# EAGLE design PWM_v1_0 (EAGLE 9.6.2)
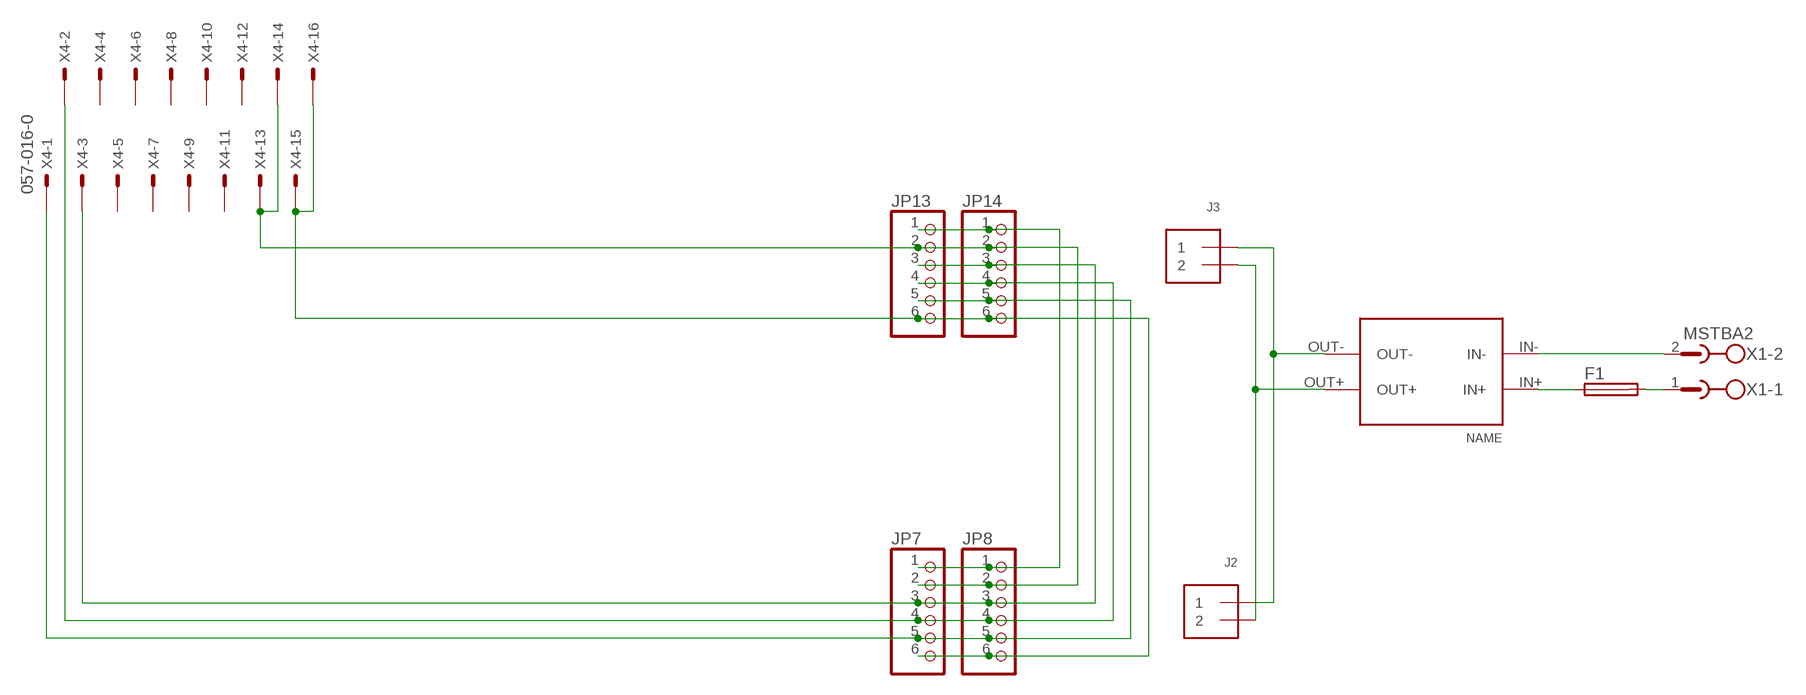
[diagram p0: schematic, sheet 1]

## Parts
F1  SH25  [SH25]
J2  TERMBLOCK_1X2  [TERMBLOCK_1X2-3.5MM]
J3  TERMBLOCK_1X2  [TERMBLOCK_1X2-3.5MM]
JP7  PINHD-1X6CB  [1X06-CLEANBIG]
JP8  PINHD-1X6CB  [1X06-CLEANBIG]
JP13  PINHD-1X6CB  [1X06-CLEANBIG]
JP14  PINHD-1X6CB  [1X06-CLEANBIG]
U$2  CP8-ADJ  [CP8-ADJ]
X1  MSTBA2  [MSTBA2]
X4  057-016-0  [057-016-0]

## Nets
N$1: J2.2 J3.2 U$2.OUT+
N$2: J2.1 J3.1 U$2.OUT-
N$3: JP7.4 JP8.4 JP13.4 JP14.4 X4.2
N$4: JP7.5 JP8.5 JP13.5 JP14.5 X4.1
N$5: JP7.6 JP8.6 JP13.6 JP14.6 X4.15 X4.16
N$6: JP7.1 JP8.1 JP13.1 JP14.1
N$7: JP7.2 JP8.2 JP13.2 JP14.2 X4.13 X4.14
N$8: U$2.IN- X1.2
N$9: F1.1 U$2.IN+
N$10: F1.2 X1.1
N$11: JP7.3 JP8.3 JP13.3 JP14.3 X4.3
Unconnected: X4.4 X4.5 X4.6 X4.7 X4.8 X4.9 X4.10 X4.11 X4.12

## Library data of the parts
F1 = fuse:SH25: FUSE HOLDER grid 25 mm, OGN0031 8211, Schurter (Buerklin); MF: SCHURTER; MPN: 0031.8211; OC_FARNELL: 1162741; OC_NEWARK: 96B9380
J2 J3 = microbuilder:TERMBLOCK_1X2: 3.5mm Terminal block http://www.ladyada.net/library/pcb/eaglelibrary.html
JP7 JP8 JP13 JP14 = adafruit:PINHD-1X6: PIN HEADER
U$2 = userlib:CP8-ADJ: Voltage regulator IN: 7-35V OUT: ADJ
X1 = con-phoenix-508:MSTBA2: PHOENIX; MF: FARNELL; MPN: 1757242; OC_FARNELL: 3705171; OC_NEWARK: 71C4161
X4 = con-panduit:057-016-: CONNECTOR 10-pin series 057 contact pc board low profile headers; OC_FARNELL: unknown; OC_NEWARK: unknown

## Board
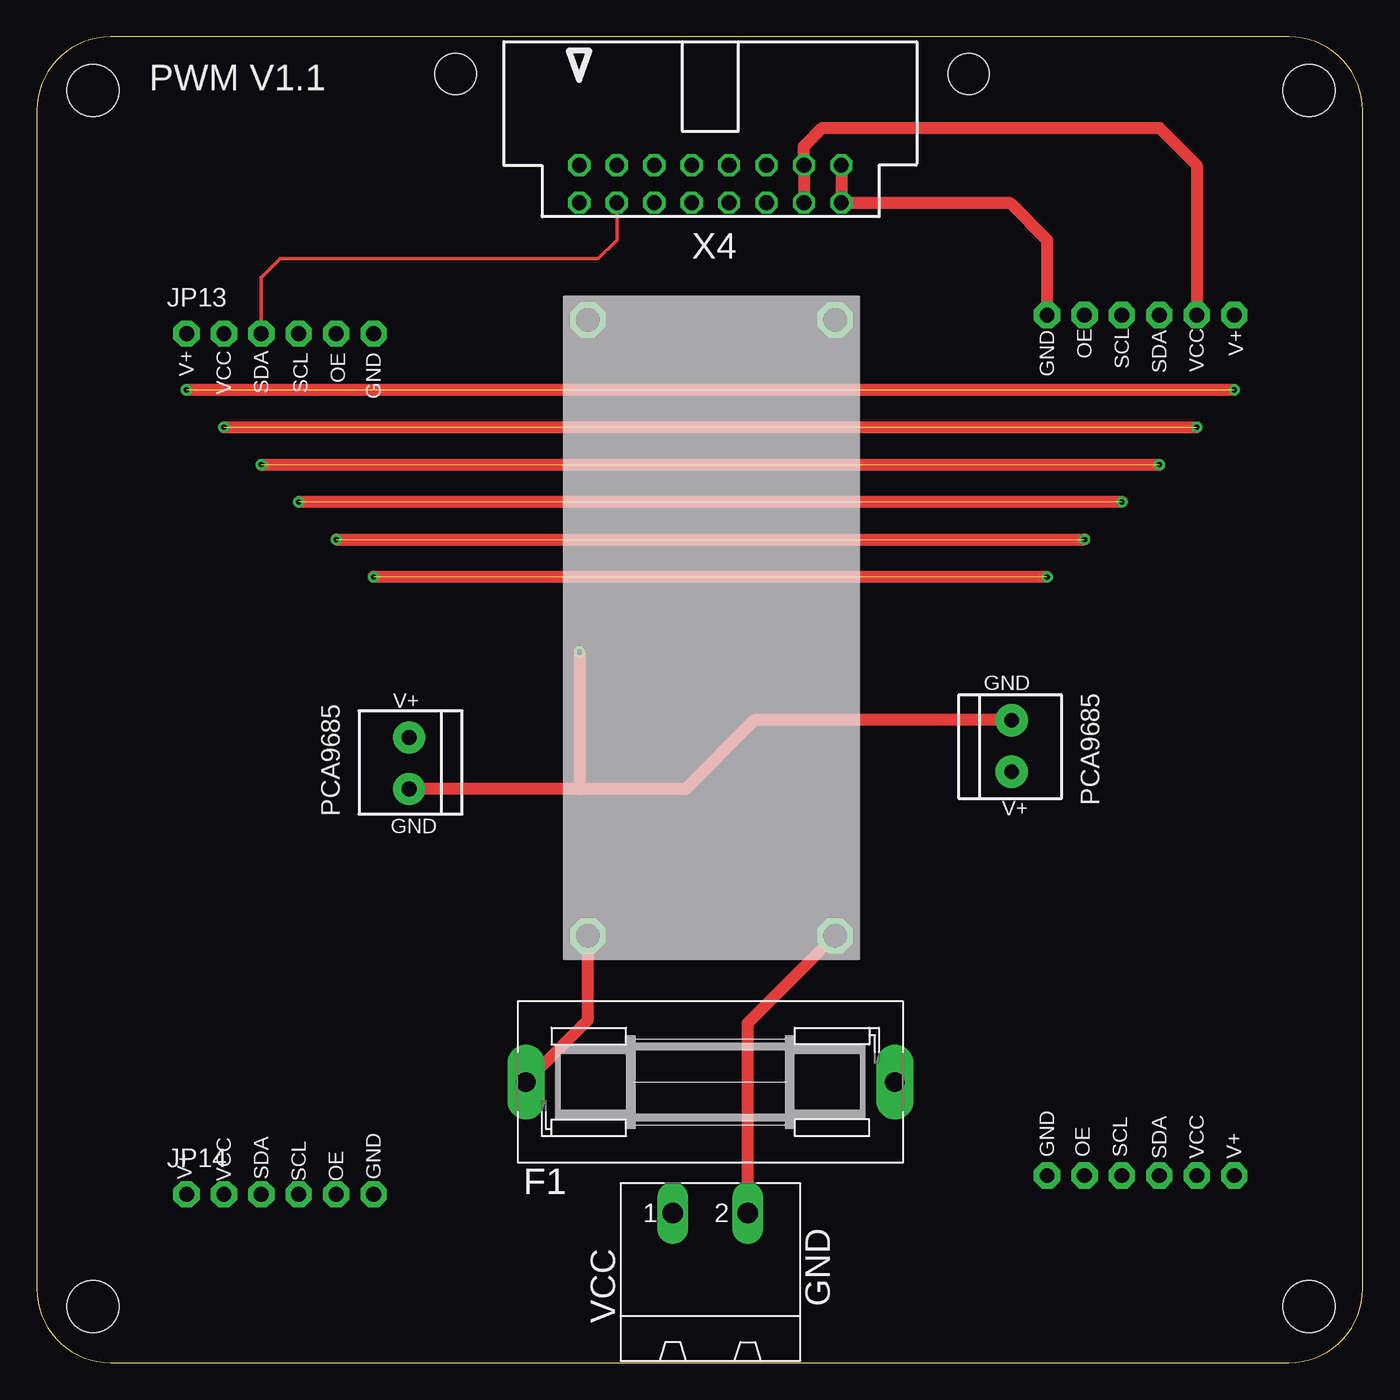
[diagram p1: board, top side]
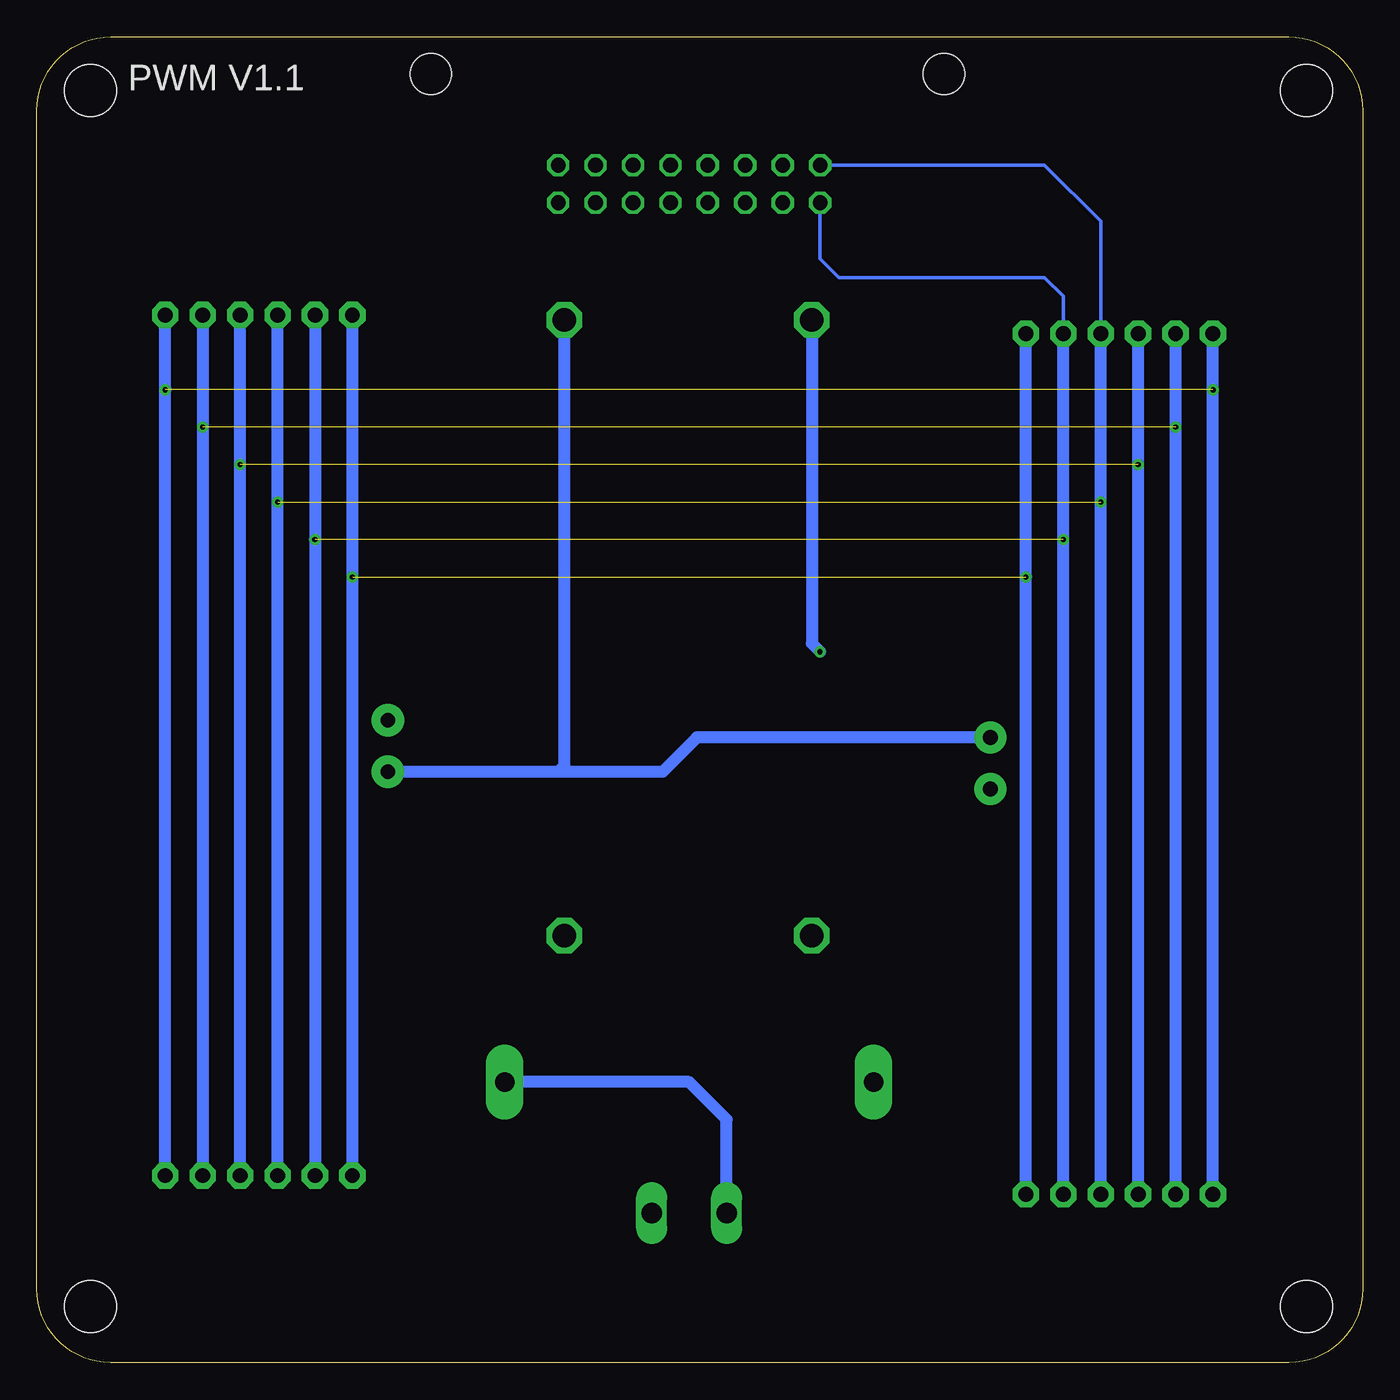
[diagram p2: board, bottom side, seen from below]

Size 90 x 90 mm. Coordinates in mm from the lower left corner, seen from the top.
Outline: 0,85 0,5 arc90 5,0 85,0 arc90 90,5 90,85 arc90 85,90 5,90 arc90 0,85
Copper layers (1*16): Top 0.035mm / dielectric 1.5mm / Bottom 0.035mm
Design rules "default": minimum track width 6mil, minimum drill 0.35mm, track to track 6mil, track to pad 6mil, pad to pad 6mil, via to via 6mil, smd to smd 6mil, copper to edge 40mil, drill to drill 6mil, minimum pad ring 10mil, minimum via ring 8mil, stop-mask expansion 4mil, vias tented up to drill 0mil, thermal gap 10mil
Holes 3.5 mm at 86.36,86.36 3.81,86.36 3.81,3.81 86.36,3.81

### Footprints (pad centres in the part's own frame; a part is rotated, then mirrored left to right if it is on the bottom)
SH25 = drill 1.321 pad 2.54 long: 1 -12.522,0; 2 12.522,0
TERMBLOCK_1X2-3.5MM = drill 1 pad 2.184: 1 1.8,0; 2 -1.7,0
1X06-CLEANBIG = drill 1.016 pad 1.778 octagon: 1 -6.35,0; 2 -3.81,0; 3 -1.27,0; 4 1.27,0; 5 3.81,0; 6 6.35,0
CP8-ADJ = drill 1.6 octagon: IN+ -21.81,7.05; IN- -21.81,-9.75; OUT+ 19.99,7.05; OUT- 19.99,-9.75
MSTBA2 = drill 1.397 long: 1 -2.54,5.08; 2 2.54,5.08
057-016-0 = drill 1 octagon: 1 -8.89,-5.08; 2 -8.89,-2.54; 3 -6.35,-5.08; 4 -6.35,-2.54; 5 -3.81,-5.08; 6 -3.81,-2.54; 7 -1.27,-5.08; 8 -1.27,-2.54; 9 1.27,-5.08; 10 1.27,-2.54; 11 3.81,-5.08; 12 3.81,-2.54; 13 6.35,-5.08; 14 6.35,-2.54; 15 8.89,-5.08; 16 8.89,-2.54 | hole 2.8: -17.29,3.66; 17.54,3.66

### Placement (x,y rotation side)
F1  45.72,19.05 0 top
J2  66.17,41.91 270 top
J3  25.27,40.64 90 top
JP7  74.93,12.7 180 top
JP8  74.93,71.12 180 top
JP13  16.51,69.85 0 top
JP14  16.51,11.43 0 top
U$2  44.45,50.8 90 top
X1  45.72,5.08 0 top
X4  45.72,83.82 0 top

### Tracks (layer width: path | path; a pad name or v marks a point on that pad's centre or on a via)
N$1  (via drill 0.35)
  Top 0.813: J2.2 48.69,43.61 44.02,38.94 36.83,38.94 | 36.83,38.94 J3.2 | v36.83,48.26 36.83,38.94
  Bottom 0.813: U$2.OUT+ 37.4,48.83 v36.83,48.26
N$2
  Bottom 0.813: J3.1 45.19,42.44 47.52,40.11 54.61,40.11 | 54.61,40.11 J2.1 | U$2.OUT- 54.2,40.52 54.61,40.11
N$3  (via drill 0.35)  (2 unrouted)
  Top 0.813: v73.66,58.42 v17.78,58.42
  Bottom 0.254: JP13.4 17.78,77.47 21.59,81.28 X4.2
  Bottom 0.813: JP14.4 v17.78,58.42 JP13.4 | JP7.4 v73.66,58.42 JP8.4
N$4  (via drill 0.35)  (2 unrouted)
  Top 0.813: v20.32,55.88 v71.12,55.88
  Bottom 0.254: JP13.5 20.32,72.39 21.59,73.66 35.56,73.66 36.83,74.93 X4.1
  Bottom 0.813: JP14.5 v20.32,55.88 JP13.5 | JP8.5 v71.12,55.88 JP7.5
N$5  (via drill 0.35)  (2 unrouted)
  Top 0.813: v68.58,53.34 v22.86,53.34 | X4.16 X4.15 66.04,78.74 68.58,76.2 JP8.6
  Bottom 0.813: JP14.6 v22.86,53.34 JP13.6 | JP7.6 v68.58,53.34 JP8.6
N$6  (via drill 0.35)  (2 unrouted)
  Top 0.813: v10.16,66.04 v81.28,66.04
  Bottom 0.813: JP14.1 v10.16,66.04 JP13.1 | JP7.1 v81.28,66.04 JP8.1
N$7  (via drill 0.35)  (2 unrouted)
  Top 0.813: v12.7,63.5 v78.74,63.5 | X4.13 X4.14 52.07,82.55 53.34,83.82 76.2,83.82 78.74,81.28 JP8.2
  Bottom 0.813: JP14.2 v12.7,63.5 JP13.2 | JP8.2 v78.74,63.5 JP7.2
N$8
  Top 0.813: X1.2 48.26,23.05 U$2.IN-
N$9
  Top 0.813: F1.1 37.4,23.25 U$2.IN+
N$10
  Bottom 0.813: X1.1 43.18,16.51 45.72,19.05 F1.2
N$11  (via drill 0.35)  (2 unrouted)
  Top 0.254: JP13.3 15.24,73.66 16.51,74.93 38.1,74.93 39.37,76.2 X4.3
  Top 0.813: v15.24,60.96 v76.2,60.96
  Bottom 0.813: JP14.3 v15.24,60.96 JP13.3 | JP7.3 v76.2,60.96 JP8.3

### Text on the board
tPlace: GND | OE | SCL | SDA | VCC | V+ | V+ | VCC | SDA | SCL | OE | GND | GND | PCA9685 | V+ | V+ | PCA9685 | GND | GND | OE | SCL | SDA | VCC | V+ | V+ | VCC | SDA | SCL | OE | GND | VCC | GND
tNames: PWM V1.1
bNames: PWM V1.1